# Altium schematic sheet Mechanical + Bridges + AFE.SchDoc: Sheetname
size A4; Organization: Thomas More: Embedded IT; Address1: Robbe Van Assche; Address2: Belgium; Address3: 2015; Address4: Proof Of Concept: An Analog Datalogger; DocumentNumber: ALT0061; Revision: A; SheetNumber: 4; SheetTotal: 4
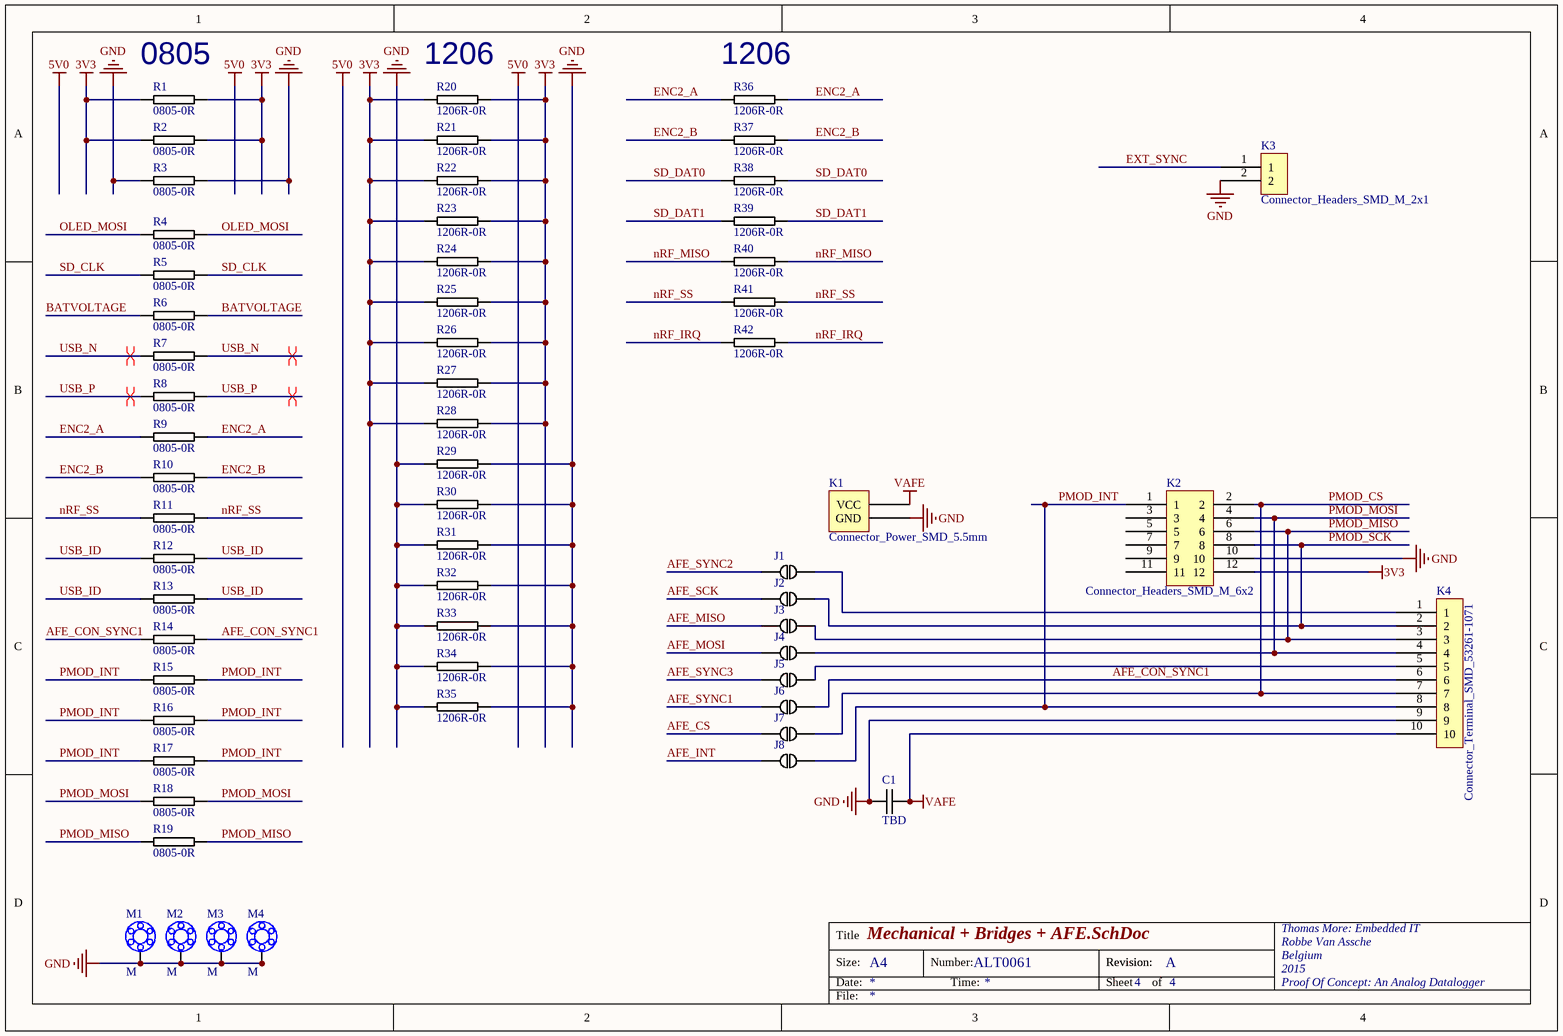
[diagram p0: Mechanical + Bridges + AFE.SchDoc]

## Parts
C1  TBD  [1210C-GENERIC]
J1  Connector_Production Connectors_SMD_BYPASS  [BYPASS]  (value not drawn)
J2  Connector_Production Connectors_SMD_BYPASS  [BYPASS]  (value not drawn)
J3  Connector_Production Connectors_SMD_BYPASS  [BYPASS]  (value not drawn)
J4  Connector_Production Connectors_SMD_BYPASS  [BYPASS]  (value not drawn)
J5  Connector_Production Connectors_SMD_BYPASS  [BYPASS]  (value not drawn)
J6  Connector_Production Connectors_SMD_BYPASS  [BYPASS]  (value not drawn)
J7  Connector_Production Connectors_SMD_BYPASS  [BYPASS]  (value not drawn)
J8  Connector_Production Connectors_SMD_BYPASS  [BYPASS]  (value not drawn)
K1  Connector_Power_SMD_5.5mm  [ADC-028]
K2  Connector_Headers_SMD_M_6x2  [Header_Male_2.54 6x2]
K3  Connector_Headers_SMD_M_2x1  [Header_Male_2.54 2x1]
K4  Connector_Terminal_SMD_53261-1071  [53261-1071]
M1  M  [MOUNTING]  (no BOM)
M2  M  [MOUNTING]  (no BOM)
M3  M  [MOUNTING]  (no BOM)
M4  M  [MOUNTING]  (no BOM)
R1  0805-0R  [0805R-GENERIC]
R2  0805-0R  [0805R-GENERIC]
R3  0805-0R  [0805R-GENERIC]
R4  0805-0R  [0805R-GENERIC]
R5  0805-0R  [0805R-GENERIC]
R6  0805-0R  [0805R-GENERIC]
R7  0805-0R  [0805R-GENERIC]
R8  0805-0R  [0805R-GENERIC]
R9  0805-0R  [0805R-GENERIC]
R10  0805-0R  [0805R-GENERIC]
R11  0805-0R  [0805R-GENERIC]
R12  0805-0R  [0805R-GENERIC]
R13  0805-0R  [0805R-GENERIC]
R14  0805-0R  [0805R-GENERIC]
R15  0805-0R  [0805R-GENERIC]
R16  0805-0R  [0805R-GENERIC]
R17  0805-0R  [0805R-GENERIC]
R18  0805-0R  [0805R-GENERIC]
R19  0805-0R  [0805R-GENERIC]
R20  1206R-0R  [1206R-GENERIC]
R21  1206R-0R  [1206R-GENERIC]
R22  1206R-0R  [1206R-GENERIC]
R23  1206R-0R  [1206R-GENERIC]
R24  1206R-0R  [1206R-GENERIC]
R25  1206R-0R  [1206R-GENERIC]
R26  1206R-0R  [1206R-GENERIC]
R27  1206R-0R  [1206R-GENERIC]
R28  1206R-0R  [1206R-GENERIC]
R29  1206R-0R  [1206R-GENERIC]
R30  1206R-0R  [1206R-GENERIC]
R31  1206R-0R  [1206R-GENERIC]
R32  1206R-0R  [1206R-GENERIC]
R33  1206R-0R  [1206R-GENERIC]
R34  1206R-0R  [1206R-GENERIC]
R35  1206R-0R  [1206R-GENERIC]
R36  1206R-0R  [1206R-GENERIC]
R37  1206R-0R  [1206R-GENERIC]
R38  1206R-0R  [1206R-GENERIC]
R39  1206R-0R  [1206R-GENERIC]
R40  1206R-0R  [1206R-GENERIC]
R41  1206R-0R  [1206R-GENERIC]
R42  1206R-0R  [1206R-GENERIC]

## Nets
3V3: K2.12 R1.1 R1.2 R2.1 R2.2 R20.1 R20.2 R21.1 R21.2 R22.1 R22.2 R23.1 R23.2 R24.1 R24.2 R25.1 R25.2 R26.1 R26.2 R27.1 R27.2 R28.1 R28.2
GND: C1.1 K1.GND K2.10 K3.2 K4.9 M1.1 M1.2 M1.3 M1.4 M1.5 M1.6 M1.7 M2.1 M2.2 M2.3 M2.4 M2.5 M2.6 M2.7 M3.1 M3.2 M3.3 M3.4 M3.5 M3.6 M3.7 M4.1 M4.2 M4.3 M4.4 M4.5 M4.6 M4.7 R3.1 R3.2 R29.1 R29.2 R30.1 R30.2 R31.1 R31.2 R32.1 R32.2 R33.1 R33.2 R34.1 R34.2 R35.1 R35.2
VAFE: C1.2 K1.VCC K4.10
AFE_CON_SYNC1: J6.2 K4.6 R14.1 R14.2
AFE_CS: J7.1
AFE_INT: J8.1
AFE_MISO: J3.1
AFE_MOSI: J4.1
AFE_SCK: J2.1
AFE_SYNC1: J6.1
AFE_SYNC2: J1.1
AFE_SYNC3: J5.1
BATVOLTAGE: R6.1 R6.2
ENC2_A: R9.1 R9.2 R36.1 R36.2
ENC2_B: R10.1 R10.2 R37.1 R37.2
EXT_SYNC: K3.1
nRF_IRQ: R42.1 R42.2
nRF_MISO: R40.1 R40.2
nRF_SS: R11.1 R11.2 R41.1 R41.2
OLED_MOSI: R4.1 R4.2
PMOD_CS: J7.2 K2.2 K4.7
PMOD_INT: J8.2 K2.1 K4.8 R15.1 R15.2 R16.1 R16.2 R17.1 R17.2
PMOD_MISO: J3.2 K2.6 K4.3 R19.1 R19.2
PMOD_MOSI: J4.2 K2.4 K4.4 R18.1 R18.2
PMOD_SCK: J2.2 K2.8 K4.2
SD_CLK: R5.1 R5.2
SD_DAT0: R38.1 R38.2
SD_DAT1: R39.1 R39.2
USB_ID: R12.1 R12.2 R13.1 R13.2
USB_N: R7.1 R7.2
USB_P: R8.1 R8.2
NetJ1_2: J1.2 K4.1
NetJ5_2: J5.2 K4.5

Not connected (* = marked no-connect by the designer): K2 3 5 7 9 11

## Layout directives
differential pair: USB_N, USB_P

## Notes on the sheet
- (near R1) 0805
- (near R20) 1206
- (near R36) 1206
- Title
- Size:
- Date:
- A4
- Number:
- Time:
- Revision:
- Sheet
- of
- File:

## Library data of the parts
C1 = Passives_Capacitors_1210_1210C-TBD: CAPACITOR 1210 CERAMIC VALUE TO BE DETERMINED
J1-J8 = Connector_Production Connectors_SMD_BYPASS: SOLDERDOT BYPASS; Manufacturer Part Number 1: Board Feature; Reel: Open; Supplier 1: Solder-it-yourself; Manufacturer 1: Board feature
K1 = Connector_Power_SMD_5.5mm: 5.5mm SMD
K2 = Connector_Headers_SMD_M_6x2: SMD Header 6x2
K3 = Connector_Headers_SMD_M_2x1: SMD Header 2x1
K4 = Connector_Terminal_SMD_53261-1071: Picoblade 10p
M1-M4 = MOUNTING: MOUNTING HOLE - NON INSTALLABLE
R1-R19 = 0805R-0R: RESISTOR 0805 1 WATT